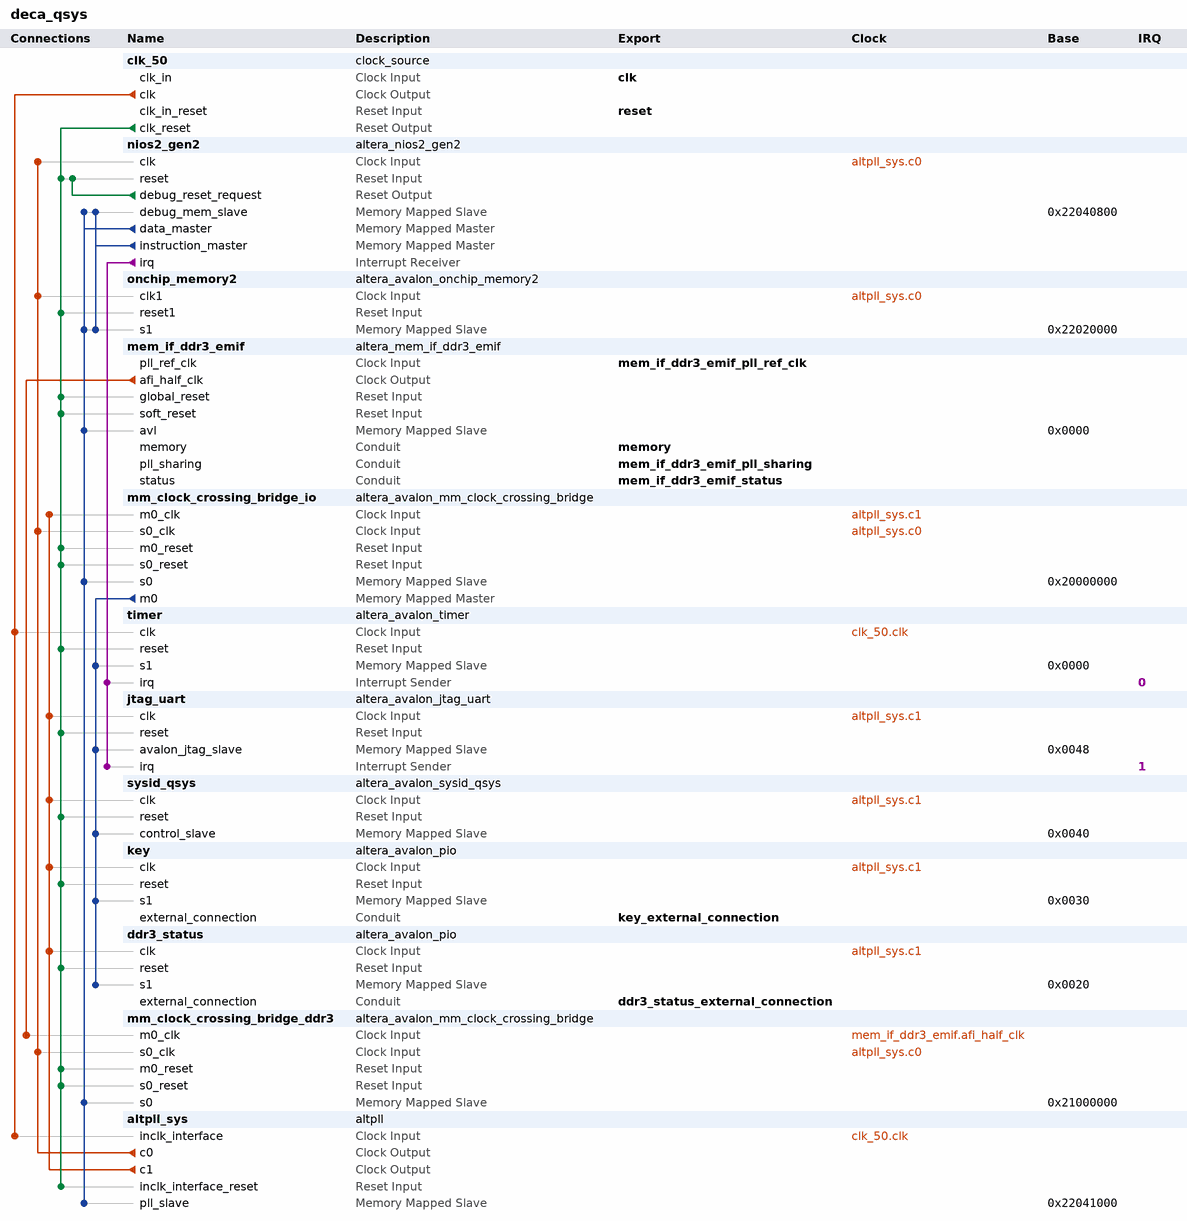
[diagram p0: system contents]
# Platform Designer (Qsys) system deca_qsys, MAX 10 10M50DAF484C6GES
# Parameters at their usual value, and those the tool derives, are not listed.
package require -exact qsys 15.0
create_system deca_qsys
set_project_property DEVICE_FAMILY {MAX 10}
set_project_property DEVICE 10M50DAF484C6GES

add_instance clk_50 clock_source 15.0
set_instance_parameter_value clk_50 clockFrequency 50000000

add_instance nios2_gen2 altera_nios2_gen2 15.0
set_instance_parameter_value nios2_gen2 dcache_size 2048
set_instance_parameter_value nios2_gen2 exceptionSlave onchip_memory2.s1
set_instance_parameter_value nios2_gen2 icache_size 4096
set_instance_parameter_value nios2_gen2 impl Fast
set_instance_parameter_value nios2_gen2 resetSlave onchip_memory2.s1

add_instance onchip_memory2 altera_avalon_onchip_memory2 15.0
set_instance_parameter_value onchip_memory2 dataWidth 32
set_instance_parameter_value onchip_memory2 dualPort false
set_instance_parameter_value onchip_memory2 initMemContent false
set_instance_parameter_value onchip_memory2 initializationFileName onchip_mem.hex
set_instance_parameter_value onchip_memory2 memorySize 128000

add_instance mem_if_ddr3_emif altera_mem_if_ddr3_emif 15.0
set_instance_parameter_value mem_if_ddr3_emif AVL_MAX_SIZE 4
set_instance_parameter_value mem_if_ddr3_emif CALIBRATION_MODE Skip
set_instance_parameter_value mem_if_ddr3_emif CPORT_TYPE_PORT Bidirectional,Bidirectional,Bidirectional,Bidirectional,Bidirectional,Bidirectional
set_instance_parameter_value mem_if_ddr3_emif EXPORT_AFI_HALF_CLK false
set_instance_parameter_value mem_if_ddr3_emif HARD_EMIF false
set_instance_parameter_value mem_if_ddr3_emif MEM_BANKADDR_WIDTH 3
set_instance_parameter_value mem_if_ddr3_emif MEM_CLK_FREQ 300.0
set_instance_parameter_value mem_if_ddr3_emif MEM_CLK_FREQ_MAX 800.0
set_instance_parameter_value mem_if_ddr3_emif MEM_COL_ADDR_WIDTH 10
set_instance_parameter_value mem_if_ddr3_emif MEM_DQ_WIDTH 16
set_instance_parameter_value mem_if_ddr3_emif MEM_FORMAT DISCRETE
set_instance_parameter_value mem_if_ddr3_emif MEM_ROW_ADDR_WIDTH 15
set_instance_parameter_value mem_if_ddr3_emif MEM_TCL 7
set_instance_parameter_value mem_if_ddr3_emif MEM_TFAW_NS 45.0
set_instance_parameter_value mem_if_ddr3_emif MEM_TRAS_NS 35.0
set_instance_parameter_value mem_if_ddr3_emif MEM_TRCD_NS 13.75
set_instance_parameter_value mem_if_ddr3_emif MEM_TRFC_NS 260.0
set_instance_parameter_value mem_if_ddr3_emif MEM_TRP_NS 13.75
set_instance_parameter_value mem_if_ddr3_emif MEM_TRRD_NS 7.5
set_instance_parameter_value mem_if_ddr3_emif MEM_TRTP_NS 7.5
set_instance_parameter_value mem_if_ddr3_emif MEM_TWTR 6
set_instance_parameter_value mem_if_ddr3_emif MEM_VENDOR Micron
set_instance_parameter_value mem_if_ddr3_emif MEM_WTCL 6
set_instance_parameter_value mem_if_ddr3_emif PLL_LOCATION Top_Bottom
set_instance_parameter_value mem_if_ddr3_emif POWER_OF_TWO_BUS true
set_instance_parameter_value mem_if_ddr3_emif PRIORITY_PORT 1,1,1,1,1,1
set_instance_parameter_value mem_if_ddr3_emif RATE Half
set_instance_parameter_value mem_if_ddr3_emif REF_CLK_FREQ 50.0
set_instance_parameter_value mem_if_ddr3_emif SPEED_GRADE 6
set_instance_parameter_value mem_if_ddr3_emif TIMING_BOARD_AC_SKEW 0.017
set_instance_parameter_value mem_if_ddr3_emif TIMING_BOARD_AC_TO_CK_SKEW -1.3E-4
set_instance_parameter_value mem_if_ddr3_emif TIMING_BOARD_DQ_TO_DQS_SKEW -6.0E-4
set_instance_parameter_value mem_if_ddr3_emif TIMING_BOARD_MAX_CK_DELAY 0.183
set_instance_parameter_value mem_if_ddr3_emif TIMING_BOARD_MAX_DQS_DELAY 0.181
set_instance_parameter_value mem_if_ddr3_emif TIMING_BOARD_SKEW_BETWEEN_DQS 0.005
set_instance_parameter_value mem_if_ddr3_emif TIMING_BOARD_SKEW_CKDQS_DIMM_MAX 0.007
set_instance_parameter_value mem_if_ddr3_emif TIMING_BOARD_SKEW_CKDQS_DIMM_MIN 0.002
set_instance_parameter_value mem_if_ddr3_emif TIMING_BOARD_SKEW_WITHIN_DQS 0.008
set_instance_parameter_value mem_if_ddr3_emif TIMING_TDH 55
set_instance_parameter_value mem_if_ddr3_emif TIMING_TDQSCK 225
set_instance_parameter_value mem_if_ddr3_emif TIMING_TDQSQ 125
set_instance_parameter_value mem_if_ddr3_emif TIMING_TDQSS 0.25
set_instance_parameter_value mem_if_ddr3_emif TIMING_TDS 55
set_instance_parameter_value mem_if_ddr3_emif TIMING_TDSH 0.2
set_instance_parameter_value mem_if_ddr3_emif TIMING_TDSS 0.2
set_instance_parameter_value mem_if_ddr3_emif TIMING_TIH 130
set_instance_parameter_value mem_if_ddr3_emif TIMING_TIS 185
set_instance_parameter_value mem_if_ddr3_emif TIMING_TQSH 0.4
set_instance_parameter_value mem_if_ddr3_emif USER_DEBUG_LEVEL 1

add_instance mm_clock_crossing_bridge_io altera_avalon_mm_clock_crossing_bridge 15.0
set_instance_parameter_value mm_clock_crossing_bridge_io ADDRESS_WIDTH 10
set_instance_parameter_value mm_clock_crossing_bridge_io COMMAND_FIFO_DEPTH 4
set_instance_parameter_value mm_clock_crossing_bridge_io DATA_WIDTH 32
set_instance_parameter_value mm_clock_crossing_bridge_io MASTER_SYNC_DEPTH 2
set_instance_parameter_value mm_clock_crossing_bridge_io MAX_BURST_SIZE 1
set_instance_parameter_value mm_clock_crossing_bridge_io RESPONSE_FIFO_DEPTH 4
set_instance_parameter_value mm_clock_crossing_bridge_io SLAVE_SYNC_DEPTH 2
set_instance_parameter_value mm_clock_crossing_bridge_io USE_AUTO_ADDRESS_WIDTH 0

add_instance timer altera_avalon_timer 15.0
set_instance_parameter_value timer period 1
set_instance_parameter_value timer periodUnits MSEC

add_instance jtag_uart altera_avalon_jtag_uart 15.0
set_instance_parameter_value jtag_uart simInteractiveOptions NO_INTERACTIVE_WINDOWS

add_instance sysid_qsys altera_avalon_sysid_qsys 15.0
set_instance_parameter_value sysid_qsys id 0

add_instance key altera_avalon_pio 15.0
set_instance_parameter_value key direction Input
set_instance_parameter_value key width 2

add_instance ddr3_status altera_avalon_pio 15.0
set_instance_parameter_value ddr3_status direction Input
set_instance_parameter_value ddr3_status width 4

add_instance mm_clock_crossing_bridge_ddr3 altera_avalon_mm_clock_crossing_bridge 15.0
set_instance_parameter_value mm_clock_crossing_bridge_ddr3 ADDRESS_WIDTH 10
set_instance_parameter_value mm_clock_crossing_bridge_ddr3 COMMAND_FIFO_DEPTH 4
set_instance_parameter_value mm_clock_crossing_bridge_ddr3 DATA_WIDTH 32
set_instance_parameter_value mm_clock_crossing_bridge_ddr3 MASTER_SYNC_DEPTH 2
set_instance_parameter_value mm_clock_crossing_bridge_ddr3 MAX_BURST_SIZE 1
set_instance_parameter_value mm_clock_crossing_bridge_ddr3 RESPONSE_FIFO_DEPTH 4
set_instance_parameter_value mm_clock_crossing_bridge_ddr3 SLAVE_SYNC_DEPTH 2
set_instance_parameter_value mm_clock_crossing_bridge_ddr3 USE_AUTO_ADDRESS_WIDTH 0

add_instance altpll_sys altpll 15.0
set_instance_parameter_value altpll_sys CLK0_DIVIDE_BY 2
set_instance_parameter_value altpll_sys CLK0_MULTIPLY_BY 5
set_instance_parameter_value altpll_sys CLK1_DIVIDE_BY 1
set_instance_parameter_value altpll_sys CLK1_DUTY_CYCLE 50
set_instance_parameter_value altpll_sys CLK1_MULTIPLY_BY 1
set_instance_parameter_value altpll_sys CLK1_PHASE_SHIFT 0
set_instance_parameter_value altpll_sys INCLK0_INPUT_FREQUENCY 20000
set_instance_parameter_value altpll_sys PORT_ARESET PORT_USED
set_instance_parameter_value altpll_sys PORT_LOCKED PORT_USED
set_instance_parameter_value altpll_sys PORT_clk1 PORT_USED
set_instance_parameter_value altpll_sys PORT_clk2 PORT_UNUSED
set_instance_parameter_value altpll_sys PORT_clk3 PORT_UNUSED

# connections
add_connection altpll_sys.c0 mm_clock_crossing_bridge_ddr3.s0_clk clock
add_connection altpll_sys.c0 mm_clock_crossing_bridge_io.s0_clk clock
add_connection altpll_sys.c0 nios2_gen2.clk clock
add_connection altpll_sys.c0 onchip_memory2.clk1 clock
add_connection altpll_sys.c1 ddr3_status.clk clock
add_connection altpll_sys.c1 jtag_uart.clk clock
add_connection altpll_sys.c1 key.clk clock
add_connection altpll_sys.c1 mm_clock_crossing_bridge_io.m0_clk clock
add_connection altpll_sys.c1 sysid_qsys.clk clock
add_connection clk_50.clk altpll_sys.inclk_interface clock
add_connection clk_50.clk timer.clk clock
add_connection mem_if_ddr3_emif.afi_half_clk mm_clock_crossing_bridge_ddr3.m0_clk clock
add_connection clk_50.clk_reset altpll_sys.inclk_interface_reset reset
add_connection clk_50.clk_reset ddr3_status.reset reset
add_connection clk_50.clk_reset jtag_uart.reset reset
add_connection clk_50.clk_reset key.reset reset
add_connection clk_50.clk_reset mem_if_ddr3_emif.global_reset reset
add_connection clk_50.clk_reset mem_if_ddr3_emif.soft_reset reset
add_connection clk_50.clk_reset mm_clock_crossing_bridge_ddr3.m0_reset reset
add_connection clk_50.clk_reset mm_clock_crossing_bridge_ddr3.s0_reset reset
add_connection clk_50.clk_reset mm_clock_crossing_bridge_io.m0_reset reset
add_connection clk_50.clk_reset mm_clock_crossing_bridge_io.s0_reset reset
add_connection clk_50.clk_reset nios2_gen2.reset reset
add_connection clk_50.clk_reset onchip_memory2.reset1 reset
add_connection clk_50.clk_reset sysid_qsys.reset reset
add_connection clk_50.clk_reset timer.reset reset
add_connection nios2_gen2.debug_reset_request nios2_gen2.reset reset
add_connection mm_clock_crossing_bridge_io.m0 ddr3_status.s1 avalon
set_connection_parameter_value mm_clock_crossing_bridge_io.m0/ddr3_status.s1 baseAddress 0x0020
add_connection mm_clock_crossing_bridge_io.m0 jtag_uart.avalon_jtag_slave avalon
set_connection_parameter_value mm_clock_crossing_bridge_io.m0/jtag_uart.avalon_jtag_slave baseAddress 0x0048
add_connection mm_clock_crossing_bridge_io.m0 key.s1 avalon
set_connection_parameter_value mm_clock_crossing_bridge_io.m0/key.s1 baseAddress 0x0030
add_connection mm_clock_crossing_bridge_io.m0 sysid_qsys.control_slave avalon
set_connection_parameter_value mm_clock_crossing_bridge_io.m0/sysid_qsys.control_slave baseAddress 0x0040
add_connection mm_clock_crossing_bridge_io.m0 timer.s1 avalon
set_connection_parameter_value mm_clock_crossing_bridge_io.m0/timer.s1 baseAddress 0x0000
add_connection nios2_gen2.data_master altpll_sys.pll_slave avalon
set_connection_parameter_value nios2_gen2.data_master/altpll_sys.pll_slave baseAddress 0x22041000
add_connection nios2_gen2.data_master mem_if_ddr3_emif.avl avalon
set_connection_parameter_value nios2_gen2.data_master/mem_if_ddr3_emif.avl baseAddress 0x0000
add_connection nios2_gen2.data_master mm_clock_crossing_bridge_ddr3.s0 avalon
set_connection_parameter_value nios2_gen2.data_master/mm_clock_crossing_bridge_ddr3.s0 baseAddress 0x21000000
add_connection nios2_gen2.data_master mm_clock_crossing_bridge_io.s0 avalon
set_connection_parameter_value nios2_gen2.data_master/mm_clock_crossing_bridge_io.s0 baseAddress 0x20000000
add_connection nios2_gen2.data_master nios2_gen2.debug_mem_slave avalon
set_connection_parameter_value nios2_gen2.data_master/nios2_gen2.debug_mem_slave baseAddress 0x22040800
add_connection nios2_gen2.data_master onchip_memory2.s1 avalon
set_connection_parameter_value nios2_gen2.data_master/onchip_memory2.s1 baseAddress 0x22020000
add_connection nios2_gen2.instruction_master nios2_gen2.debug_mem_slave avalon
set_connection_parameter_value nios2_gen2.instruction_master/nios2_gen2.debug_mem_slave baseAddress 0x22040800
add_connection nios2_gen2.instruction_master onchip_memory2.s1 avalon
set_connection_parameter_value nios2_gen2.instruction_master/onchip_memory2.s1 baseAddress 0x22020000
add_connection nios2_gen2.irq jtag_uart.irq interrupt
set_connection_parameter_value nios2_gen2.irq/jtag_uart.irq irqNumber 1
add_connection nios2_gen2.irq timer.irq interrupt
set_connection_parameter_value nios2_gen2.irq/timer.irq irqNumber 0

# exported interfaces
add_interface clk clock sink
set_interface_property clk EXPORT_OF clk_50.clk_in
add_interface ddr3_status_external_connection conduit end
set_interface_property ddr3_status_external_connection EXPORT_OF ddr3_status.external_connection
add_interface key_external_connection conduit end
set_interface_property key_external_connection EXPORT_OF key.external_connection
add_interface mem_if_ddr3_emif_pll_ref_clk clock sink
set_interface_property mem_if_ddr3_emif_pll_ref_clk EXPORT_OF mem_if_ddr3_emif.pll_ref_clk
add_interface mem_if_ddr3_emif_pll_sharing conduit end
set_interface_property mem_if_ddr3_emif_pll_sharing EXPORT_OF mem_if_ddr3_emif.pll_sharing
add_interface mem_if_ddr3_emif_status conduit end
set_interface_property mem_if_ddr3_emif_status EXPORT_OF mem_if_ddr3_emif.status
add_interface memory conduit end
set_interface_property memory EXPORT_OF mem_if_ddr3_emif.memory
add_interface reset reset sink
set_interface_property reset EXPORT_OF clk_50.clk_in_reset

set_interconnect_requirement {$system} qsys_mm.clockCrossingAdapter HANDSHAKE
set_interconnect_requirement {$system} qsys_mm.enableEccProtection FALSE
set_interconnect_requirement {$system} qsys_mm.insertDefaultSlave FALSE
set_interconnect_requirement {$system} qsys_mm.maxAdditionalLatency 1

save_system deca_qsys.qsys
